# Altium schematic sheet SPI_Interface.SchDoc
size B
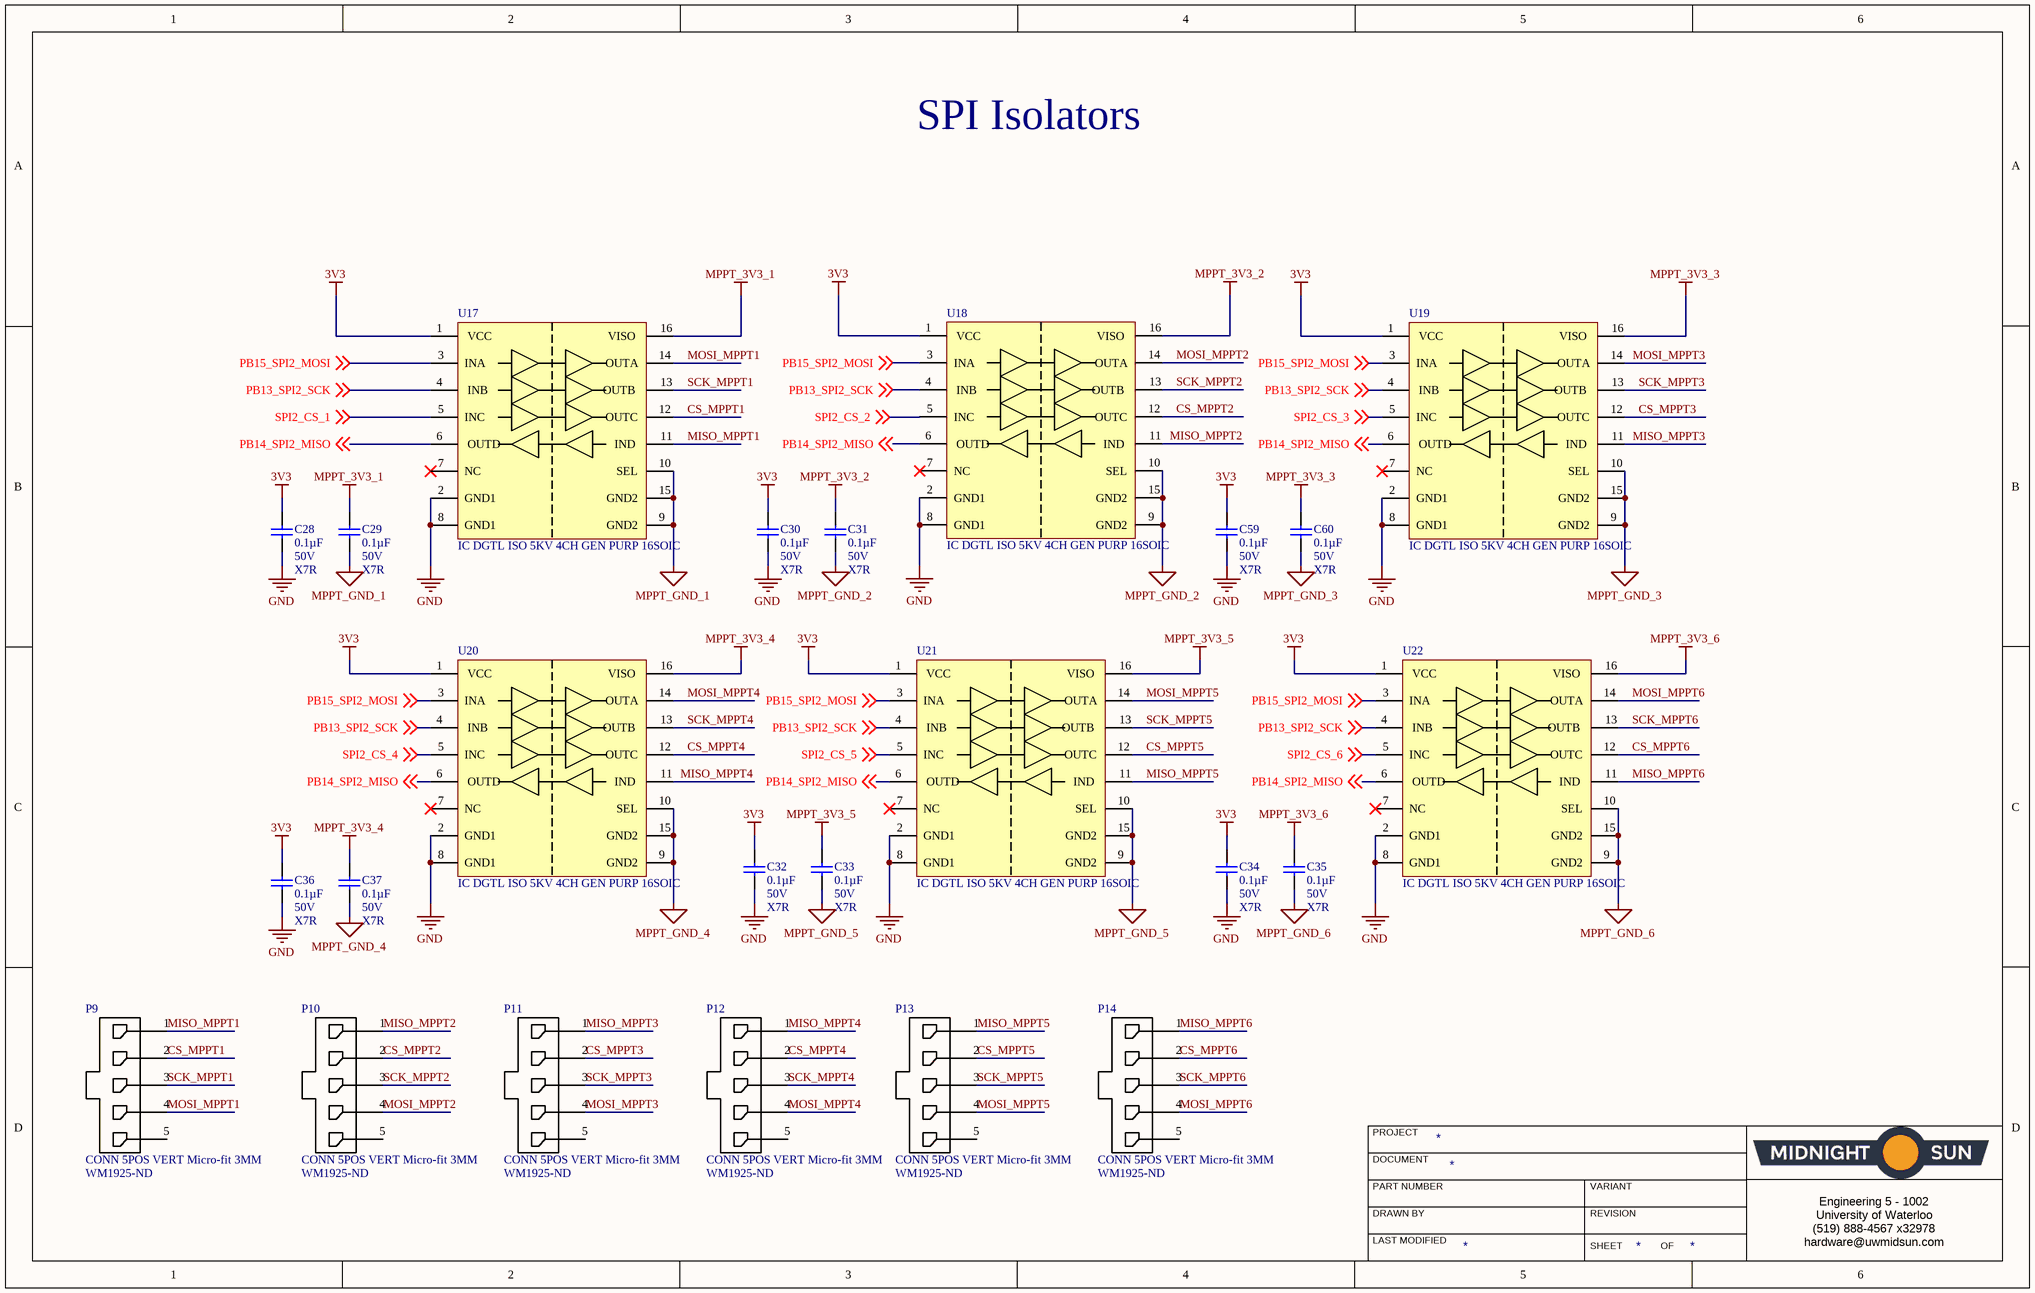
[diagram p0: SPI_Interface.SchDoc]

## Parts
C28  Capacitance: 0.1µF  Voltage: 50V  Temperature Coefficient: X7R  [CAP, 0603]  (hidden comment: CAP CER 0.1UF 50V 10% X7R 0603)
C29  Capacitance: 0.1µF  Voltage: 50V  Temperature Coefficient: X7R  [CAP, 0603]  (hidden comment: CAP CER 0.1UF 50V 10% X7R 0603)
C30  Capacitance: 0.1µF  Voltage: 50V  Temperature Coefficient: X7R  [CAP, 0603]  (hidden comment: CAP CER 0.1UF 50V 10% X7R 0603)
C31  Capacitance: 0.1µF  Voltage: 50V  Temperature Coefficient: X7R  [CAP, 0603]  (hidden comment: CAP CER 0.1UF 50V 10% X7R 0603)
C32  Capacitance: 0.1µF  Voltage: 50V  Temperature Coefficient: X7R  [CAP, 0603]  (hidden comment: CAP CER 0.1UF 50V 10% X7R 0603)
C33  Capacitance: 0.1µF  Voltage: 50V  Temperature Coefficient: X7R  [CAP, 0603]  (hidden comment: CAP CER 0.1UF 50V 10% X7R 0603)
C34  Capacitance: 0.1µF  Voltage: 50V  Temperature Coefficient: X7R  [CAP, 0603]  (hidden comment: CAP CER 0.1UF 50V 10% X7R 0603)
C35  Capacitance: 0.1µF  Voltage: 50V  Temperature Coefficient: X7R  [CAP, 0603]  (hidden comment: CAP CER 0.1UF 50V 10% X7R 0603)
C36  Capacitance: 0.1µF  Voltage: 50V  Temperature Coefficient: X7R  [CAP, 0603]  (hidden comment: CAP CER 0.1UF 50V 10% X7R 0603)
C37  Capacitance: 0.1µF  Voltage: 50V  Temperature Coefficient: X7R  [CAP, 0603]  (hidden comment: CAP CER 0.1UF 50V 10% X7R 0603)
C59  Capacitance: 0.1µF  Voltage: 50V  Temperature Coefficient: X7R  [CAP, 0603]  (hidden comment: CAP CER 0.1UF 50V 10% X7R 0603)
C60  Capacitance: 0.1µF  Voltage: 50V  Temperature Coefficient: X7R  [CAP, 0603]  (hidden comment: CAP CER 0.1UF 50V 10% X7R 0603)
P9  CONN 5POS VERT Micro-fit 3MM  Supplier Part Number 1: WM1925-ND  [CONN, 5POS MICRO-FIT 3mm]
P10  CONN 5POS VERT Micro-fit 3MM  Supplier Part Number 1: WM1925-ND  [CONN, 5POS MICRO-FIT 3mm]
P11  CONN 5POS VERT Micro-fit 3MM  Supplier Part Number 1: WM1925-ND  [CONN, 5POS MICRO-FIT 3mm]
P12  CONN 5POS VERT Micro-fit 3MM  Supplier Part Number 1: WM1925-ND  [CONN, 5POS MICRO-FIT 3mm]
P13  CONN 5POS VERT Micro-fit 3MM  Supplier Part Number 1: WM1925-ND  [CONN, 5POS MICRO-FIT 3mm]
P14  CONN 5POS VERT Micro-fit 3MM  Supplier Part Number 1: WM1925-ND  [CONN, 5POS MICRO-FIT 3mm]
U17  IC DGTL ISO 5KV 4CH GEN PURP 16SOIC  [ISOW7841FDWER SOIC-16]
U18  IC DGTL ISO 5KV 4CH GEN PURP 16SOIC  [ISOW7841FDWER SOIC-16]
U19  IC DGTL ISO 5KV 4CH GEN PURP 16SOIC  [ISOW7841FDWER SOIC-16]
U20  IC DGTL ISO 5KV 4CH GEN PURP 16SOIC  [ISOW7841FDWER SOIC-16]
U21  IC DGTL ISO 5KV 4CH GEN PURP 16SOIC  [ISOW7841FDWER SOIC-16]
U22  IC DGTL ISO 5KV 4CH GEN PURP 16SOIC  [ISOW7841FDWER SOIC-16]

## Nets
3V3: C28.1 C30.1 C32.1 C34.1 C36.1 C59.1 U17.1(VCC) U18.1(VCC) U19.1(VCC) U20.1(VCC) U21.1(VCC) U22.1(VCC)
GND: C28.2 C30.2 C32.2 C34.2 C36.2 C59.2 U17.2(GND1) U17.8(GND1) U18.2(GND1) U18.8(GND1) U19.2(GND1) U19.8(GND1) U20.2(GND1) U20.8(GND1) U21.2(GND1) U21.8(GND1) U22.2(GND1) U22.8(GND1)
MPPT_3V3_1: C29.1 U17.16(VISO)
MPPT_3V3_2: C31.1 U18.16(VISO)
MPPT_3V3_3: C60.1 U19.16(VISO)
MPPT_3V3_4: C37.1 U20.16(VISO)
MPPT_3V3_5: C33.1 U21.16(VISO)
MPPT_3V3_6: C35.1 U22.16(VISO)
MPPT_GND_1: C29.2 U17.9(GND2) U17.10(SEL) U17.15(GND2)
MPPT_GND_2: C31.2 U18.9(GND2) U18.10(SEL) U18.15(GND2)
MPPT_GND_3: C60.2 U19.9(GND2) U19.10(SEL) U19.15(GND2)
MPPT_GND_4: C37.2 U20.9(GND2) U20.10(SEL) U20.15(GND2)
MPPT_GND_5: C33.2 U21.9(GND2) U21.10(SEL) U21.15(GND2)
MPPT_GND_6: C35.2 U22.9(GND2) U22.10(SEL) U22.15(GND2)
CS_MPPT1: P9.2 U17.12(OUTC)
CS_MPPT2: P10.2 U18.12(OUTC)
CS_MPPT3: P11.2 U19.12(OUTC)
CS_MPPT4: P12.2 U20.12(OUTC)
CS_MPPT5: P13.2 U21.12(OUTC)
CS_MPPT6: P14.2 U22.12(OUTC)
MISO_MPPT1: P9.1 U17.11(IND)
MISO_MPPT2: P10.1 U18.11(IND)
MISO_MPPT3: P11.1 U19.11(IND)
MISO_MPPT4: P12.1 U20.11(IND)
MISO_MPPT5: P13.1 U21.11(IND)
MISO_MPPT6: P14.1 U22.11(IND)
MOSI_MPPT1: P9.4 U17.14(OUTA)
MOSI_MPPT2: P10.4 U18.14(OUTA)
MOSI_MPPT3: P11.4 U19.14(OUTA)
MOSI_MPPT4: P12.4 U20.14(OUTA)
MOSI_MPPT5: P13.4 U21.14(OUTA)
MOSI_MPPT6: P14.4 U22.14(OUTA)
PB13_SPI2_SCK: U17.4(INB) U18.4(INB) U19.4(INB) U20.4(INB) U21.4(INB) U22.4(INB) ; off-sheet PB13_SPI2_SCK
PB14_SPI2_MISO: U17.6(OUTD) U18.6(OUTD) U19.6(OUTD) U20.6(OUTD) U21.6(OUTD) U22.6(OUTD) ; off-sheet PB14_SPI2_MISO
PB15_SPI2_MOSI: U17.3(INA) U18.3(INA) U19.3(INA) U20.3(INA) U21.3(INA) U22.3(INA) ; off-sheet PB15_SPI2_MOSI
SCK_MPPT1: P9.3 U17.13(OUTB)
SCK_MPPT2: P10.3 U18.13(OUTB)
SCK_MPPT3: P11.3 U19.13(OUTB)
SCK_MPPT4: P12.3 U20.13(OUTB)
SCK_MPPT5: P13.3 U21.13(OUTB)
SCK_MPPT6: P14.3 U22.13(OUTB)
SPI2_CS_1: U17.5(INC) ; off-sheet SPI2_CS_1
SPI2_CS_2: U18.5(INC) ; off-sheet SPI2_CS_2
SPI2_CS_3: U19.5(INC) ; off-sheet SPI2_CS_3
SPI2_CS_4: U20.5(INC) ; off-sheet SPI2_CS_4
SPI2_CS_5: U21.5(INC) ; off-sheet SPI2_CS_5
SPI2_CS_6: U22.5(INC) ; off-sheet SPI2_CS_6

Not connected (* = marked no-connect by the designer): P9 5; P10 5; P11 5; P12 5; P13 5; P14 5; U17 7(NC)*; U18 7(NC)*; U19 7(NC)*; U20 7(NC)*; U21 7(NC)*; U22 7(NC)*

## Notes on the sheet
- SPI Isolators
- PROJECT
- DOCUMENT
- DRAWN BY
- LAST MODIFIED
- PART NUMBER
- REVISION
- SHEET
- VARIANT
- OF
- Engineering 5 - 1002
  University of Waterloo
  (519) 888-4567 x32978
  hardware@uwmidsun.com

## Library data of the parts
C28-C37 C59 C60 = CAP CER 0.1UF 50V 10% X7R 0603: 0.10µF ±10% 50V Ceramic Capacitor X7R 0603 (1608 Metric); Manufacturer 1: AVX Corporation; Manufacturer Part Number 1: 06035C104KAT2A; Supplier 1: Digi-Key; Supplier Part Number 1: 478-5052-1-ND; Packaging: Cut Tape (CT); Part Status: Active; Operating Temperature: -55°C ~ 125°C; Ratings: -; Mounting Type: Surface Mount, MLCC; Package / Case: 0603 (1608 Metric); Size / Dimension: 0.063" L x 0.032" W (1.60mm x 0.81mm); Height - Seated (Max): -; Thickness (Max): 0.035" (0.90mm); Lead Spacing: -; Lead Style: -; ComponentLink1URL: http://datasheets.avx.com/X7RDielectric.pdf; ComponentLink1Description: http://datasheets.avx.com/X7RDielectric.pdf; Tolerance: ±10%
P9-P14 = CONN 5POS VERT Micro-fit 3MM: Conn Power HDR 5 POS 3mm Solder ST Thru-Hole 5 Terminal 1 Port Micro-Fit 3.0™ Tray; Manufacturer: Molex; Manufacturer Part Number: 0436500516; Number of Positions: 5; Connector Type: Male Pin; Number of Ports: 1; Max Voltage Rating (AC): 250V; Supplier 1: Digi-Key; RoHS: Yes; Category: Headers and Wire Housings; Stock 1: 1615; Pricing 1: 1=1.52000, 10=1.38200, 100=1.18480, 500=0.98736, 1000=0.84630, 5000=0.75039, 10000=0.73346 (USD); Mount: Through Hole; Color: Black; Housing Material: Polymer; Contact Material: Brass; Contact Plating: Gold; Number of Terminals: 5; Min Operating Temperature: -40°C; Max Operating Temperature: 105°C; Packaging: Tray; Termination: Solder; Orientation: Straight; Number of Rows: 1; Number of Contacts: 5; Fastening Type: Ramp; Length: 18.65mm; Pitch: 3mm; Depth: 5.57mm; ComponentLink1URL: https://datasheet.ciiva.com/6813/436500516-sd-6813986.pdf?src-supplier=Digi-Key; ComponentLink1Description: https://datasheet.ciiva.com/6813/436500516-sd-6813986.pdf?src-supplier=Digi-Key; ComponentLink2URL: https://datasheet.ciiva.com/3943/304280436500516-pcb-headers-3943315.pdf?src-supplier=Arrow; ComponentLink2Description: https://datasheet.ciiva.com/3943/304280436500516-pcb-headers-3943315.pdf?src-supplier=Arrow
U17-U22 = IC DGTL ISO 5KV 4CH GEN PURP 16SOIC: General Purpose Digital Isolator 5000Vrms 4 Channel 100Mbps 100kV/µs CMTI 16-SOIC (0.295", 7.50mm Width); Manufacturer 1: Texas Instruments; Manufacturer Part Number 1: ISOW7841FDWER; Number of Channels: 4; RoHS: No; Min Operating Temperature: -40°C; Max Operating Temperature: 125°C; Supplier 1: TI store; Supplier Part Number 1: ISOW7841FDWER; Stock 1: 4512; Pricing 1: 1=9.44000, 10=8.50000, 25=7.93000, 100=7.12000, 250=6.64000, 500=5.78000, 750=5.00000, 1000=4.90000 (USD); ComponentLink3URL: http://www.ti.com/lit/ds/symlink/isow7841.pdf?src-supplier=Digi-Key; ComponentLink3Description: http://www.ti.com/lit/ds/symlink/isow7841.pdf?src-supplier=Digi-Key; ComponentLink4URL: http://www.ti.com/general/docs/lit/getliterature.tsp?genericPartNumber=ISOW7841&fileType=pdf&src-supplier=Farnell; ComponentLink4Description: http://www.ti.com/general/docs/lit/getliterature.tsp?genericPartNumber=ISOW7841&fileType=pdf&src-supplier=Farnell